# EAGLE design Pcb (EAGLE 9.5.1)
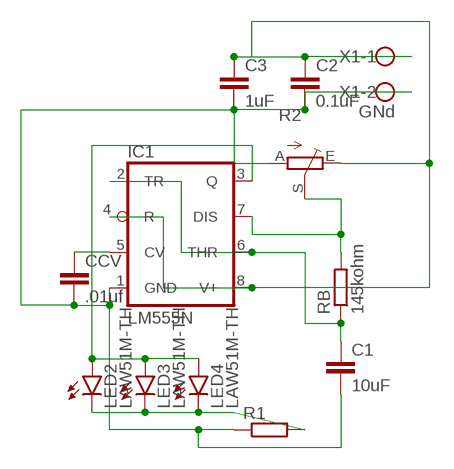
[diagram p0: schematic, sheet 1]

## Parts
C1  10uF  C2.5/2  [C2.5-2]
C2  0.1uF  C-EU025-024X044  [C025-024X044]
C3  1uF  C2.5/2  [C2.5-2]
CCV  .01uf  C2.5/2  [C2.5-2]
IC1  LM555N  [DIL08]
LED2  LAW51M-TH  [W51-COOL]
LED3  LAW51M-TH  [W51-COOL]
LED4  LAW51M-TH  [W51-COOL]
R1  R-EU_0309/12  [0309/12]
R2  TRIM_EU-B25P  [B25P]
RB  145kohm  R-EU_0309/12  [0309/12]
X1  GNd  W237-102  [W237-102]

## Nets
N$1: C1.1 IC1.2(TR) IC1.6(THR) RB.1
N$2: IC1.7(DIS) R2.S RB.2
N$4: LED2.C LED3.C LED4.C R1.2
N$5: C1.2 C2.2 C3.2 CCV.2 IC1.1(GND) R1.1 R2.A X1.2
N$6: CCV.1 IC1.5(CV)
N$7: C2.1 C3.1 IC1.4(R) IC1.8(V+) R2.E X1.1
N$8: IC1.3(Q) LED2.A LED3.A LED4.A
Unconnected: LED2.TH@1(TH) LED2.TH@2(TH) LED2.TH@3(TH) LED2.TH@4(TH) LED2.TH@5(TH) LED2.TH@6(TH) LED2.TH@7(TH) LED2.TH@8(TH) LED2.TH@9(TH) LED2.TH@10(TH) LED2.TH@11(TH) LED2.TH@12(TH) LED3.TH@1(TH) LED3.TH@2(TH) LED3.TH@3(TH) LED3.TH@4(TH) LED3.TH@5(TH) LED3.TH@6(TH) LED3.TH@7(TH) LED3.TH@8(TH) LED3.TH@9(TH) LED3.TH@10(TH) LED3.TH@11(TH) LED3.TH@12(TH) LED4.TH@1(TH) LED4.TH@2(TH) LED4.TH@3(TH) LED4.TH@4(TH) LED4.TH@5(TH) LED4.TH@6(TH) LED4.TH@7(TH) LED4.TH@8(TH) LED4.TH@9(TH) LED4.TH@10(TH) LED4.TH@11(TH) LED4.TH@12(TH)

## Library data of the parts
C1 C3 CCV = capacitor-wima:C: CAPACITOR naming: grid - package width
C2 = rcl:C-EU: CAPACITOR, European symbol; SPICEPREFIX: C
IC1 = linear:*555: TIMER
LED2-LED4 = led:*W51M-TH: Golden DRAGON® with Lens Enhanced Thinfilm LED Source: LA_LR_LY_W51M_Pb_free[1].pdf
R1 RB = rcl:R-EU_: RESISTOR, European symbol; SPICEPREFIX: R
R2 = pot:TRIM_EU-: POTENTIOMETER
X1 = con-wago-500:W237-102: WAGO SCREW CLAMP; MPN: 237-102; OC_FARNELL: unknown; OC_NEWARK: 70K9898

## Board
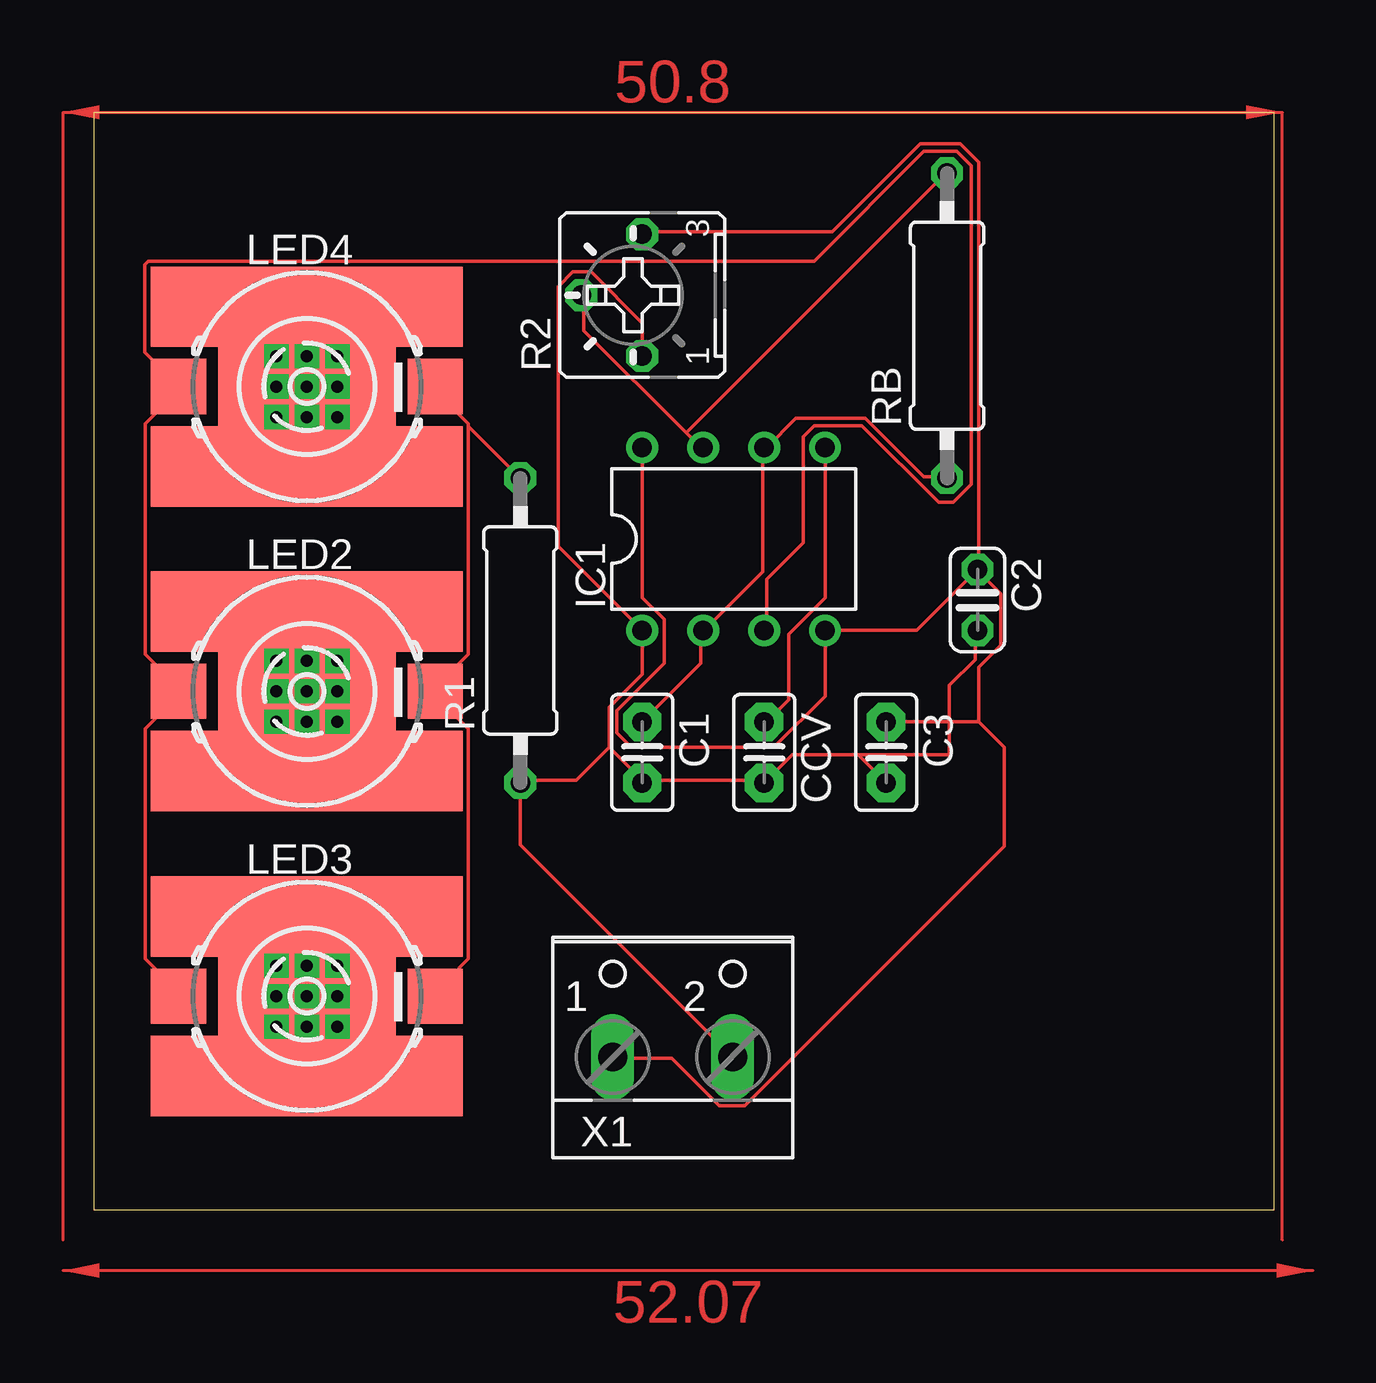
[diagram p1: board, top side]

Size 49.2 x 45.71 mm. Coordinates in mm from the lower left corner, seen from the top.
Outline: 0,0 49.2,0 49.2,45.71 0,45.71 0,0
Copper layers (1*16): Top 0.035mm / dielectric 1.5mm / Bottom 0.035mm
Design rules "default": minimum track width 6mil, minimum drill 0.35mm, track to track 6mil, track to pad 6mil, pad to pad 6mil, via to via 6mil, smd to smd 6mil, copper to edge 40mil, drill to drill 6mil, minimum pad ring 10mil, minimum via ring 8mil, stop-mask expansion 4mil, vias tented up to drill 0mil, thermal gap 10mil

### Footprints (pad centres in the part's own frame; a part is rotated, then mirrored left to right if it is on the bottom)
C2.5-2 = drill 0.813 pad 1.6 octagon: 1 -1.27,0; 2 1.27,0
C025-024X044 = drill 0.813 octagon: 1 -1.27,0; 2 1.27,0
DIL08 = drill 0.813 pad 1.27: 1 -3.81,-3.81; 2 -1.27,-3.81; 3 1.27,-3.81; 4 3.81,-3.81; 5 3.81,3.81; 6 1.27,3.81; 7 -1.27,3.81; 8 -3.81,3.81
W51-COOL = smd 2.3 x 2.3: A -5.35,0; C 5.35,0 | smd 7.4 x 3.4: TH@1 0,0 | smd 13 x 3.35: TH@2 0,3.325; TH@3 0,-3.325 | drill 0.5 pad 0.9 square: TH@4 -1.27,1.27; TH@5 0,1.27; TH@6 1.27,1.27; TH@7 -1.27,0; TH@8 0,0; TH@9 1.27,0; TH@10 -1.27,-1.27; TH@11 0,-1.27; TH@12 1.27,-1.27
0309/12 = drill 0.813 octagon: 1 -6.35,0; 2 6.35,0
B25P = drill 0.813 octagon: A -2.54,0; E 2.54,0; S 0,2.54
W237-102 = drill 1.194 long: 1 -2.5,-1.27; 2 2.5,-1.27

### Placement (x,y rotation side)
C1  22.86,19.05 270 top
C2  36.83,25.4 270 top
C3  33.02,19.05 270 top
CCV  27.94,19.05 270 top
IC1  26.67,27.94 0 top
LED2  8.89,21.59 0 top
LED3  8.89,8.89 0 top
LED4  8.89,34.29 0 top
R1  17.78,24.13 90 top
R2  22.86,38.1 90 top
RB  35.56,36.83 90 top
X1  24.13,7.62 0 top

### Tracks (layer width: path | path; a pad name or v marks a point on that pad's centre or on a via)
N$1
  Top 0.152: C1.1 25.3,22.76 25.3,24.13 IC1.2 25.45,24.13 27.89,26.57 27.89,31.75 IC1.6 28.04,31.75 29.26,32.97 32.16,32.97 34.59,30.53 35.51,30.53 RB.1
N$2
  Top 0.152: 24.69,32.36 20.42,36.63 20.42,38 R2.S | 24.69,32.36 25.3,31.75 IC1.7 | 24.69,32.36 35.51,43.18 RB.2
N$4
  Top 0.152: LED4.C 14.24,34.11 15.62,32.73 15.62,32.64 | 15.62,32.64 15.62,23.14 14.24,21.77 LED2.C 14.24,21.41 15.62,20.03 15.62,10.45 15.24,10.07 15.24,8.89 LED3.C | R1.2 15.62,32.64
N$5
  Top 0.152: X1.2 17.78,15.2 R1.1 17.83,17.88 20.12,17.88 21.49,19.25 | C3.2 31.85,18.95 | C2.2 36.73,24.13 36.73,22.91 35.66,21.84 35.66,18.95 31.85,18.95 | 21.49,19.25 21.49,20.93 22.86,22.3 IC1.1 19.36,27.63 19.36,38.46 19.96,39.06 20.73,39.06 22.86,36.93 R2.A | 22.86,17.88 21.49,19.25 | 22.86,17.88 27.89,17.88 CCV.2 29.11,18.95 31.85,18.95 | 22.86,17.88 C1.2
N$6
  Top 0.152: IC1.5 30.48,25.5 28.96,23.98 28.96,21.23 28.04,20.32 CCV.1
N$7
  Top 0.152: IC1.8 22.86,25.5 23.77,24.59 23.77,22.76 21.79,20.78 21.79,19.86 22.4,19.25 28.35,19.25 30.48,21.39 IC1.4 34.29,24.13 C2.1 | R2.E 22.86,40.74 30.79,40.74 34.44,44.4 36.12,44.4 36.88,43.64 36.88,26.72 C2.1 | 36.88,20.32 36.88,22.61 37.79,23.52 37.79,25.65 36.88,26.57 C2.1 | 36.88,20.32 37.95,19.25 37.95,15.14 27.13,4.32 26.06,4.32 24.08,6.3 21.64,6.3 X1.1 | 36.88,20.32 C3.1
N$8
  Top 0.152: LED3.A 3.54,9.07 2.16,10.45 2.16,20.03 3.54,21.41 LED2.A 3.54,21.77 2.16,23.14 2.16,32.73 3.54,34.11 LED4.A 3.51,34.34 2.13,35.71 2.13,39.37 2.29,39.52 30.02,39.52 34.59,44.09 35.97,44.09 36.58,43.48 36.58,30.23 35.81,29.46 35.2,29.46 32,32.66 30.02,32.66 29.57,32.21 29.57,27.79 28.04,26.26 28.04,24.13 IC1.3
(copper drawn outside any net)
  shapes: Top area x2